# EAGLE design macropad_synthplug_long (EAGLE 9.6.2)
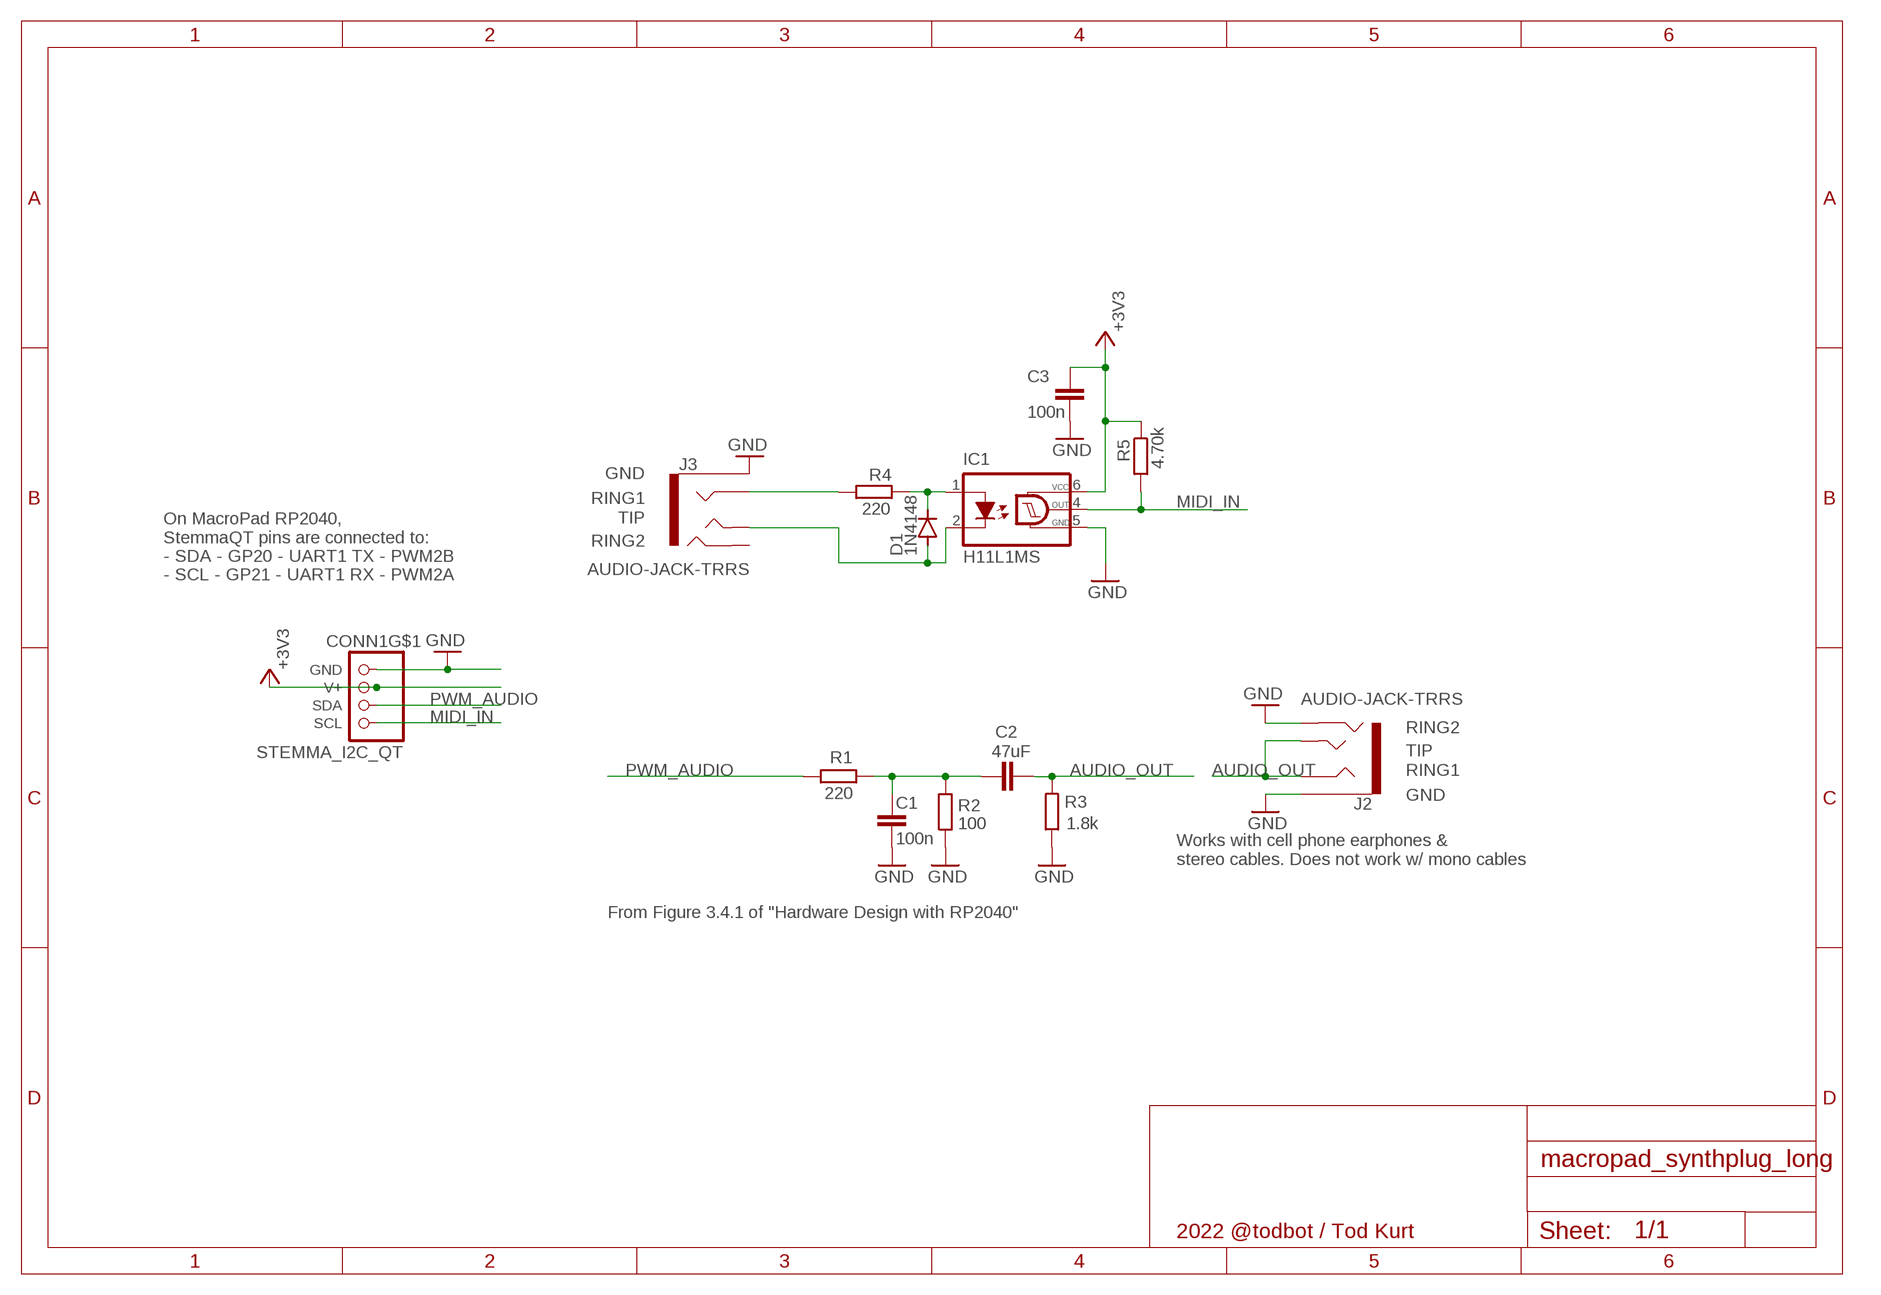
[diagram p0: schematic, sheet 1]

## Parts
C1  100n  C-EUC0805  [C0805]
C2  47uF  C-EUC0805  [C0805]
C3  100n  C-EUC0805  [C0805]
CONN1  STEMMA_I2C_QT  [JST_SH4]
D1  1N4148  DIODE-SOD123  [SOD123]
IC1  H11L1MS  [DIL6-SMD]
J2  AUDIO-JACK-TRRS  [PJ-320D_SPARKFUN]
J3  AUDIO-JACK-TRRS  [PJ-320D_SPARKFUN]
R1  220  R-EU_R0805  [R0805]
R2  100  R-EU_R0805  [R0805]
R3  1.8k  R-EU_R0805  [R0805]
R4  220  R-EU_R0805  [R0805]
R5  4.70k  R-EU_R0805  [R0805]

## Nets
+3V3: C3.1 CONN1.2(V+) IC1.6(VCC) R5.1
AUDIO_OUT: C2.2 J2.RING1 J2.TIP R3.1
GND: C1.2 C3.2 CONN1.1(GND) IC1.5(GND) J2.EARTH J2.RING2 J3.EARTH R2.1 R3.2
MIDI_IN: CONN1.4(SCL) IC1.4(OUT) R5.2
N$2: J3.RING1 R4.2
N$13: D1.C IC1.1(A) R4.1
N$14: D1.A IC1.2(C) J3.TIP
N$48: C1.1 C2.1 R1.1 R2.2
PWM_AUDIO: CONN1.3(SDA) R1.2
Unconnected: CONN1.MT1(MT) CONN1.MT2(MT) J3.RING2

## Notes on the sheet
- GND
- RING1
- TIP
- RING2
- On MacroPad RP2040, 
  StemmaQT pins are connected to:
  - SDA - GP20 - UART1 TX - PWM2B
  - SCL - GP21 - UART1 RX - PWM2A
- RING2
- TIP
- RING1
- GND
- Works with cell phone earphones &
  stereo cables. Does not work w/ mono cables
- From Figure 3.4.1 of "Hardware Design with RP2040"
- 2022 @todbot / Tod Kurt

## Library data of the parts
C1-C3 = rcl:C-EU: CAPACITOR, European symbol; SPICEPREFIX: C
CONN1 = adafruit_electromech:STEMMA_I2C; LCSC: C2845363; LCSC2: C160404; MPN: HC-1.0-4PWT; MPN2: SM04B-SRSS-TB
D1 = diode:DIODE-: DIODE
IC1 = optocoupler:H11L*M: 6-Pin DIP Optocoupler Source: http://www.fairchildsemi.com/ds/H1/H11L2-M.pdf; LCSC: C78589; MPN2: H11L1S; OC_FARNELL: unknown; OC_NEWARK: unknown
J2 J3 = audio_jacks_todbot:AUDIO-JACK-TRRS; LCSC: C431535; MPN: PJ-320D
R1-R5 = rcl:R-EU_: RESISTOR, European symbol; SPICEPREFIX: R

## Board
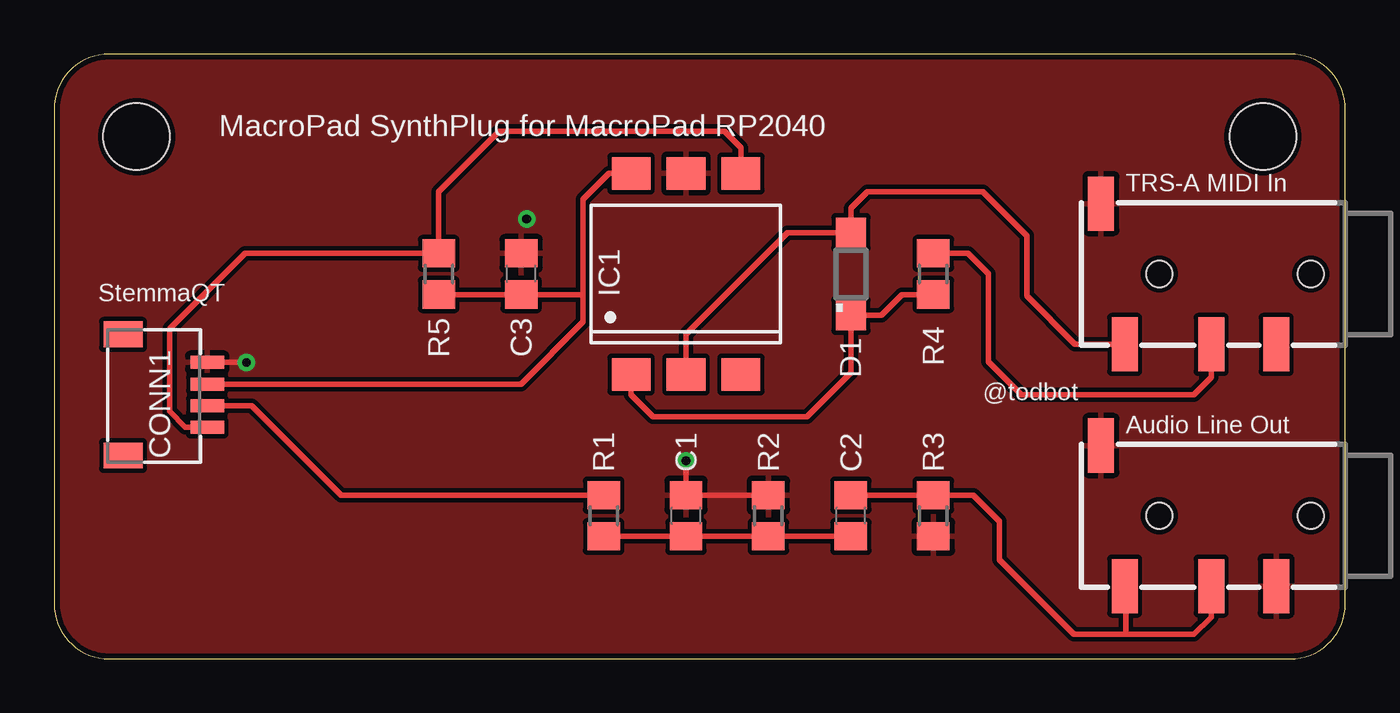
[diagram p1: board, top side]
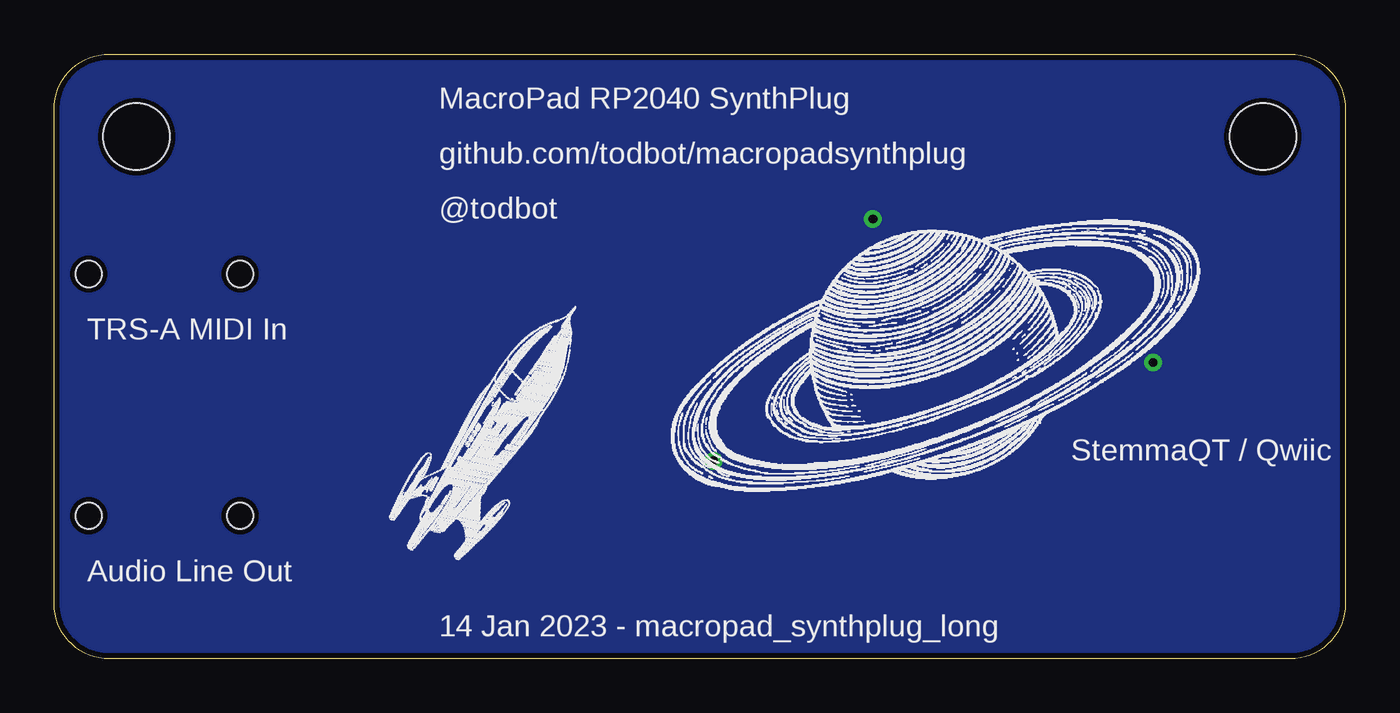
[diagram p2: board, bottom side, seen from below]

Size 59.69 x 27.94 mm. Coordinates in mm from the lower left corner, seen from the top.
Outline: 57.15,27.94 2.54,27.94 arc90 0,25.4 0,2.54 arc90 2.54,0 57.15,0 arc90 59.69,2.54 59.69,25.4 arc90 57.15,27.94
Copper layers (1*16): Top 0.035mm / dielectric 1.5mm / Bottom 0.035mm
Design rules "adafruit-rules-20180530": minimum track width 8mil, minimum drill 16mil, track to track 8mil, track to pad 8mil, pad to pad 8mil, via to via 8mil, smd to smd 8mil, copper to edge 10mil, drill to drill 8mil, minimum pad ring 10mil, minimum via ring 8mil, stop-mask expansion 4mil, vias tented up to drill 20mil, thermal gap 10mil
Holes 3.05 mm at 3.81,24.13 55.88,24.13

### Footprints (pad centres in the part's own frame; a part is rotated, then mirrored left to right if it is on the bottom)
C0805 = smd 1.3 x 1.5: 1 -0.95,0; 2 0.95,0
JST_SH4 = smd 0.6 x 1.55: 1 -1.5,2.006; 2 -0.5,2.006; 3 0.5,2.006; 4 1.5,2.006 | smd 1.2 x 1.8: MT1 -2.8,-1.894; MT2 2.8,-1.894
SOD123 = smd 1.4 x 1.4: A 1.9,0; C -1.9,0
DIL6-SMD = smd 1.78 x 1.52: 1 -2.54,-4.645; 2 0,-4.645; 3 2.54,-4.645; 4 2.54,4.645; 5 0,4.645; 6 -2.54,4.645
PJ-320D_SPARKFUN = smd 1.2 x 2.5: EARTH 11.3,-3.25; RING1 6.2,3.25; RING2 3.2,3.25; TIP 10.2,3.25 | hole 1.2: 1.6,0; 8.6,0
R0805 = smd 1.3 x 1.5: 1 -0.95,0; 2 0.95,0

### Placement (x,y rotation side)
C1  29.21,6.6 90 top
C2  36.83,6.6 90 top
C3  21.59,17.78 90 top
CONN1  5.08,12.19 270 top
D1  36.83,17.78 90 top
IC1  29.21,17.78 0 top
J2  59.69,6.6 180 top
J3  59.69,17.78 180 top
R1  25.4,6.6 90 top
R2  33.02,6.6 270 top
R3  40.64,6.6 270 top
R4  40.64,17.78 90 top
R5  17.78,17.78 90 top
U$1  [VINTAGE_SATURN]  31.75,7.62 0 bottom
U$2  [VINTAGE_SPACESHIP_SM1]  44.45,5.08 350 bottom

### Tracks (layer width: path | path; a pad name or v marks a point on that pad's centre or on a via)
+3V3
  Top 0.254: IC1.6 25.65,22.43 24.46,21.23 24.46,16.76 | CONN1.2 21.58,12.69 24.46,15.57 24.46,16.76 | R5.1 C3.1 24.39,16.83 24.46,16.76
AUDIO_OUT
  Top 0.254: C2.2 R3.1 42.48,7.55 43.69,6.35 43.69,4.57 47.13,1.13 49.53,1.13 | J2.RING1 53.49,1.93 52.69,1.13 49.53,1.13 | J2.TIP 49.53,3.31 49.53,1.13
GND  (via drill 0.41)
  Top 0.254: R2.1 C1.2 v29.21,9.14 | v8.89,13.69 CONN1.1
  other vias: 21.84,20.32
  pour Top: -1.27,28.7 60.96,28.7 60.96,-2.03 -1.27,-2.03
  pour Bottom: -1.27,29.21 60.96,29.21 60.96,-2.03 -1.27,-2.03
MIDI_IN
  Top 0.254: CONN1.4 6.07,10.69 5.33,11.43 5.33,15.24 8.82,18.73 R5.2 17.78,21.59 20.57,24.38 30.99,24.38 31.75,23.62 IC1.4
N$2
  Top 0.254: J3.RING1 53.49,13.01 52.68,12.19 44.7,12.19 43.18,13.72 43.18,17.78 42.23,18.73 R4.2
N$13
  Top 0.254: IC1.1 26.67,12.19 27.69,11.18 34.8,11.18 36.83,13.21 D1.C 38.23,15.88 39.18,16.83 R4.1
N$14
  Top 0.254: J3.TIP 47.19,14.53 44.96,16.76 44.96,19.56 42.93,21.59 37.59,21.59 36.83,20.83 D1.A 33.9,19.68 29.21,14.99 IC1.2
N$48
  Top 0.254: C2.1 R2.2 C1.1 R1.1
PWM_AUDIO
  Top 0.254: CONN1.3 9.14,11.69 13.27,7.55 R1.2

### Text on the board
tPlace: MacroPad SynthPlug for MacroPad RP2040 | TRS-A MIDI In | StemmaQT | . | @todbot | Audio Line Out
bPlace: MacroPad RP2040 SynthPlug | github.com/todbot/macropadsynthplug | @todbot | TRS-A MIDI In | StemmaQT / Qwiic | Audio Line Out | 14 Jan 2023 - macropad_synthplug_long